# EAGLE design C_Arduino_MEGA2560_ref (EAGLE 6.5.0)
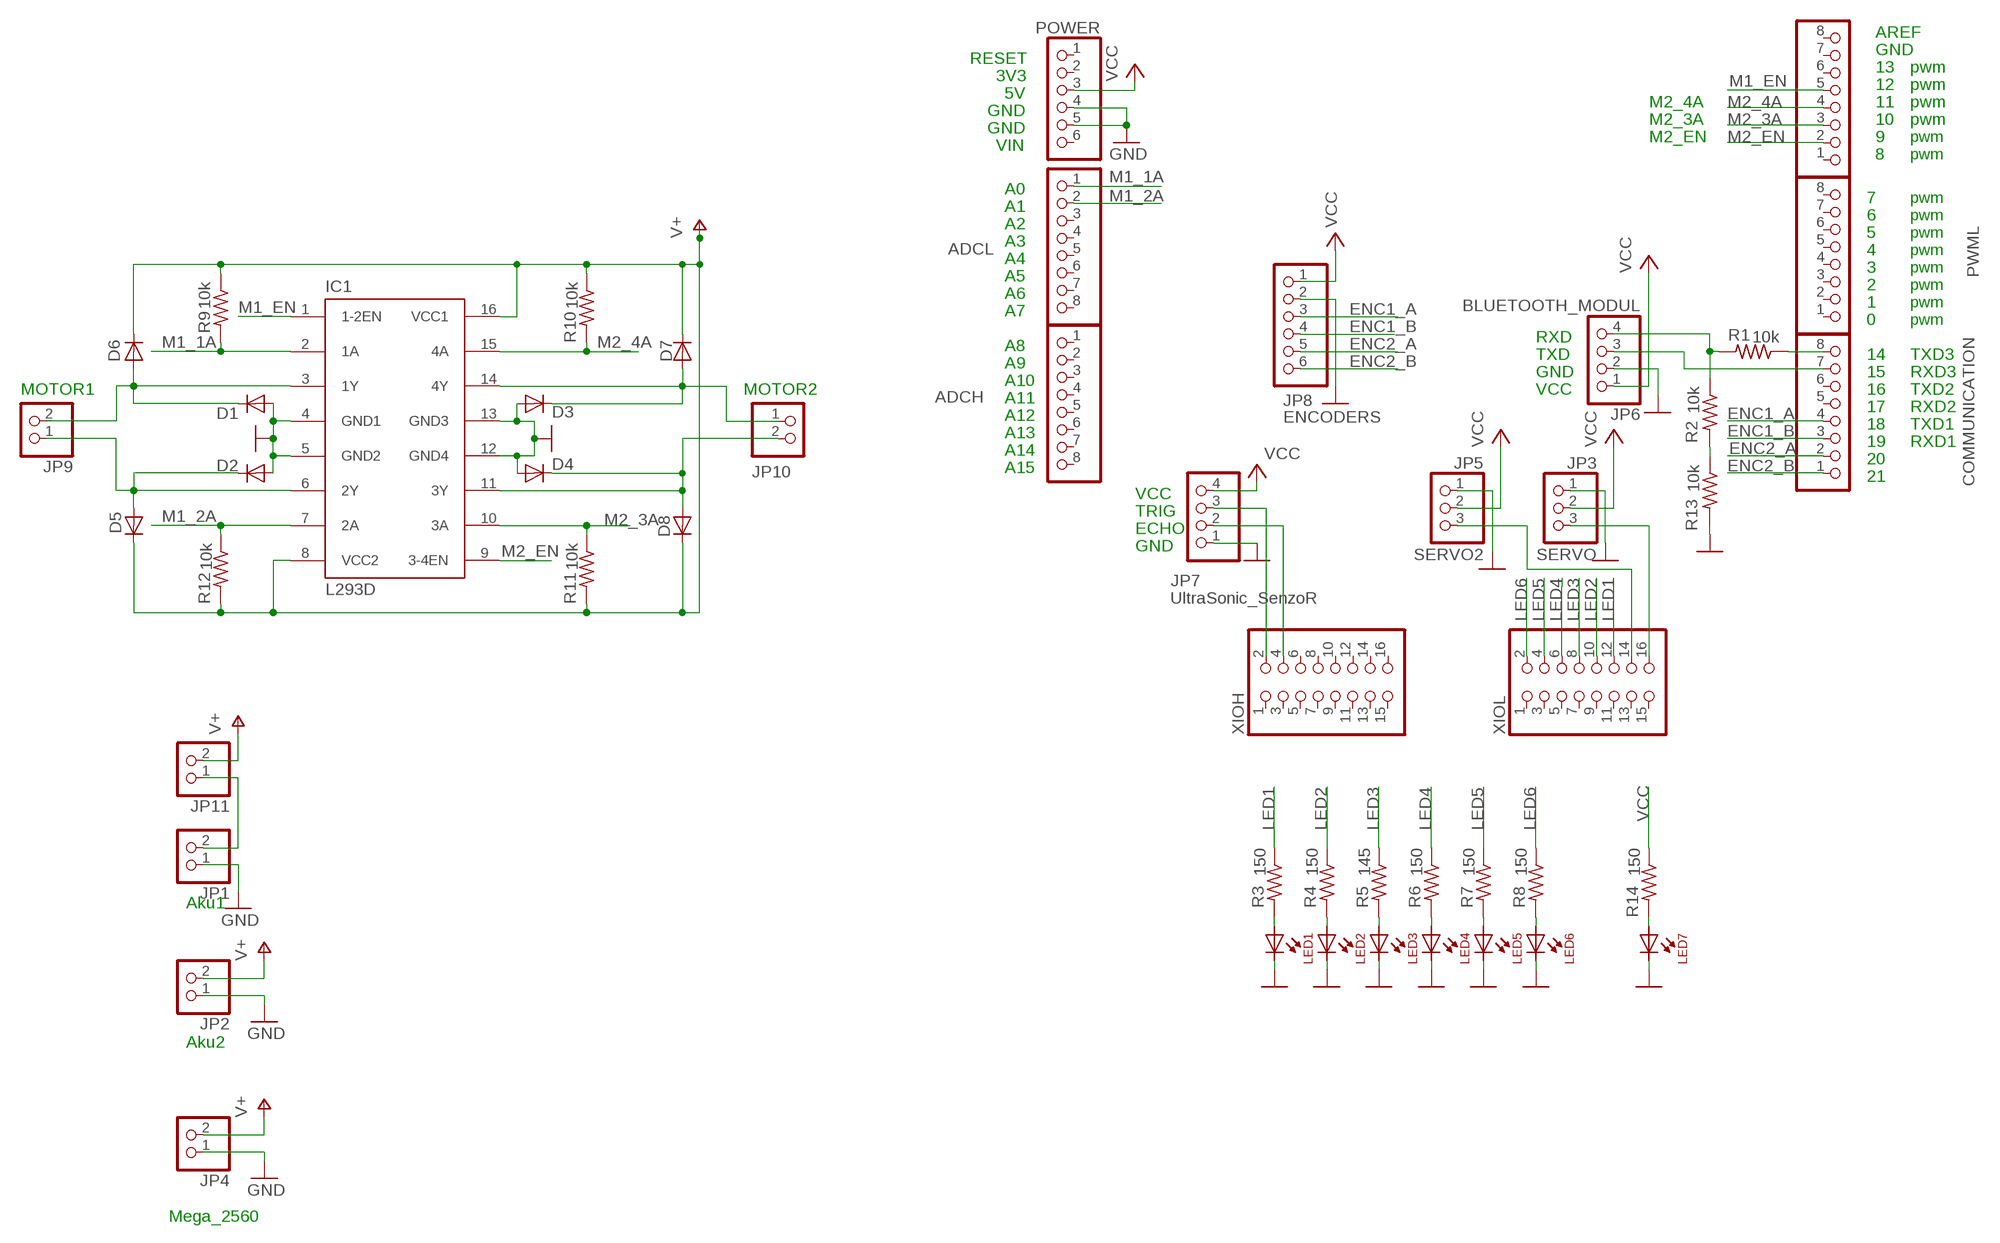
[diagram p0: schematic, sheet 1]

## Parts
ADCH  PINHD-1X8  [1X08]
ADCL  PINHD-1X8  [1X08]
COMMUNICATION  PINHD-1X8  [1X08]
D1  PMLL4150  [SOD80C]
D2  PMLL4150  [SOD80C]
D3  PMLL4150  [SOD80C]
D4  PMLL4150  [SOD80C]
D5  PMLL4150  [SOD80C]
D6  PMLL4150  [SOD80C]
D7  PMLL4150  [SOD80C]
D8  PMLL4150  [SOD80C]
IC1  L293D  [DIL16]
JP1  PINHD-1X2  [1X02]
JP2  PINHD-1X2  [1X02]
JP3  SERVO  PINHD-1X3  [1X03]
JP4  PINHD-1X2  [1X02]
JP5  SERVO2  PINHD-1X3  [1X03]
JP6  BLUETOOTH_MODUL  PINHD-1X4  [1X04]
JP7  UltraSonic_SenzoR  PINHD-1X4  [1X04]
JP8  ENCODERS  PINHD-1X6  [1X06]
JP9  PINHD-1X2  [1X02]
JP10  PINHD-1X2  [1X02]
JP11  PINHD-1X2  [1X02]
LED1  LED_Y_SMD  [LED_Y_SMD]
LED2  LED_Y_SMD  [LED_Y_SMD]
LED3  LED_Y_SMD  [LED_Y_SMD]
LED4  LED_Y_SMD  [LED_Y_SMD]
LED5  LED_Y_SMD  [LED_Y_SMD]
LED6  LED_Y_SMD  [LED_Y_SMD]
LED7  LED_Y_SMD  [LED_Y_SMD]
POWER  PINHD-1X6  [1X06]
PWMH  PINHD-1X8  [1X08]
PWML  PINHD-1X8  [1X08]
R1  10k  R-US_R0805  [R0805]
R2  10k  R-US_R0805  [R0805]
R3  150  R-US_R0805  [R0805]
R4  150  R-US_R0805  [R0805]
R5  145  R-US_R0805  [R0805]
R6  150  R-US_R0805  [R0805]
R7  150  R-US_R0805  [R0805]
R8  150  R-US_R0805  [R0805]
R9  10k  R-US_R0805  [R0805]
R10  10k  R-US_R0805  [R0805]
R11  10k  R-US_R0805  [R0805]
R12  10k  R-US_R0805  [R0805]
R13  10k  R-US_R0805  [R0805]
R14  150  R-US_R0805  [R0805]
XIOH  PINHD-2X8  [2X08]
XIOL  PINHD-2X8  [2X08]

## Nets
ENC1_A: COMMUNICATION.4 JP8.3
ENC1_B: COMMUNICATION.3 JP8.4
ENC2_A: COMMUNICATION.2 JP8.5
ENC2_B: COMMUNICATION.1 JP8.6
GND [Ground]: D1.A D2.A D3.A D4.A IC1.4(GND1) IC1.5(GND2) IC1.12(GND4) IC1.13(GND3) JP1.1 JP2.1 JP3.1 JP4.1 JP5.1 JP6.2 JP7.1 JP8.2 LED1.CATHODE LED2.CATHODE LED3.CATHODE LED4.CATHODE LED5.CATHODE LED6.CATHODE LED7.CATHODE POWER.4 POWER.5 R13.2
LED1: R3.1 XIOL.12
LED2: R4.1 XIOL.10
LED3: R5.1 XIOL.8
LED4: R6.1 XIOL.6
LED5: R7.1 XIOL.4
LED6: R8.1 XIOL.2
M1_1A: ADCL.1 IC1.2(1A) R9.2
M1_2A: ADCL.2 IC1.7(2A) R12.1
M1_EN: IC1.1(1-2EN) PWMH.5
M2_3A: IC1.10(3A) PWMH.3 R11.1
M2_4A: IC1.15(4A) PWMH.4 R10.2
M2_EN: IC1.9(3-4EN) PWMH.2
N$1: D1.C D6.A IC1.3(1Y) JP9.2
N$2: D2.C D5.A IC1.6(2Y) JP9.1
N$3: D3.C D7.A IC1.14(4Y) JP10.1
N$4: D4.C D8.A IC1.11(3Y) JP10.2
N$5: JP3.3 XIOL.16
N$6: COMMUNICATION.7 JP6.3
N$7: COMMUNICATION.8 R1.1
N$8: JP6.4 R1.2 R2.1
N$9: R2.2 R13.1
N$10: JP7.2 XIOH.4
N$11: JP7.3 XIOH.2
N$12: LED1.ANODE R3.2
N$13: LED2.ANODE R4.2
N$14: LED3.ANODE R5.2
N$15: LED4.ANODE R6.2
N$16: LED5.ANODE R7.2
N$17: LED6.ANODE R8.2
N$18: JP5.3 XIOL.14
N$19: LED7.ANODE R14.2
N$20: JP1.2 JP11.1
V+: D5.C D6.C D7.C D8.C IC1.8(VCC2) IC1.16(VCC1) JP2.2 JP4.2 JP11.2 R9.1 R10.1 R11.2 R12.2
VCC [VCC_]: JP3.2 JP5.2 JP6.1 JP7.4 JP8.1 POWER.3 R14.1
Unconnected: ADCH.1 ADCH.2 ADCH.3 ADCH.4 ADCH.5 ADCH.6 ADCH.7 ADCH.8 ADCL.3 ADCL.4 ADCL.5 ADCL.6 ADCL.7 ADCL.8 COMMUNICATION.5 COMMUNICATION.6 POWER.1 POWER.2 POWER.6 PWMH.1 PWMH.6 PWMH.7 PWMH.8 PWML.1 PWML.2 PWML.3 PWML.4 PWML.5 PWML.6 PWML.7 PWML.8 XIOH.1 XIOH.3 XIOH.5 XIOH.6 XIOH.7 XIOH.8 XIOH.9 XIOH.10 XIOH.11 XIOH.12 XIOH.13 XIOH.14 XIOH.15 XIOH.16 XIOL.1 XIOL.3 XIOL.5 XIOL.7 XIOL.9 XIOL.11 XIOL.13 XIOL.15

## Notes on the sheet
- AREF
- GND
- RESET
- 13 | pwm
- 3V3
- 12 | pwm
- 5V
- M2_4A | 11 | pwm
- GND
- M2_3A | 10 | pwm
- GND
- M2_EN | 9 | pwm
- VIN
- 8 | pwm
- A0
- 7 | pwm
- A1
- 6 | pwm
- A2
- 5 | pwm
- A3
- 4 | pwm
- A4
- 3 | pwm
- A5
- 2 | pwm
- A6
- 1 | pwm
- A7
- 0 | pwm
- RXD
- A8
- TXD | 14 | TXD3
- A9
- GND | 15 | RXD3
- A10
- MOTOR1 | MOTOR2 | VCC | 16 | TXD2
- A11
- 17 | RXD2
- A12
- 18 | TXD1
- A13
- 19 | RXD1
- A14
- 20
- A15
- 21
- VCC
- TRIG
- ECHO
- GND
- Aku1
- Aku2
- Mega_2560

## Library data of the parts
ADCH ADCL COMMUNICATION PWMH PWML = pinhead:PINHD-1X8: PIN HEADER
D1-D8 = diode:PMLL4150: DIODE high speed
IC1 = st-microelectronics:L293D: PUSH-PULL 4 CHANNEL DRIVER; MPN: L293D; OC_FARNELL: 9589619; OC_NEWARK: 56P8249
JP1 JP2 JP4 JP9-JP11 = pinhead:PINHD-1X2: PIN HEADER
JP3 JP5 = pinhead:PINHD-1X3: PIN HEADER
JP6 JP7 = pinhead:PINHD-1X4: PIN HEADER
JP8 POWER = pinhead:PINHD-1X6: PIN HEADER
LED1-LED7 = my_lib:LED_Y_SMD
R1-R14 = adafruit:R-US_: RESISTOR, American symbol
XIOH XIOL = pinhead:PINHD-2X8: PIN HEADER

## Net classes
0 default: width 0.508 mm, drill 20 mm, clearance 0.2 mm
1 Ground: width 1.016 mm, drill 20 mm, clearance 0.2 mm
2 VCC_: width 1.016 mm, drill 20 mm, clearance 0.2 mm

## Board
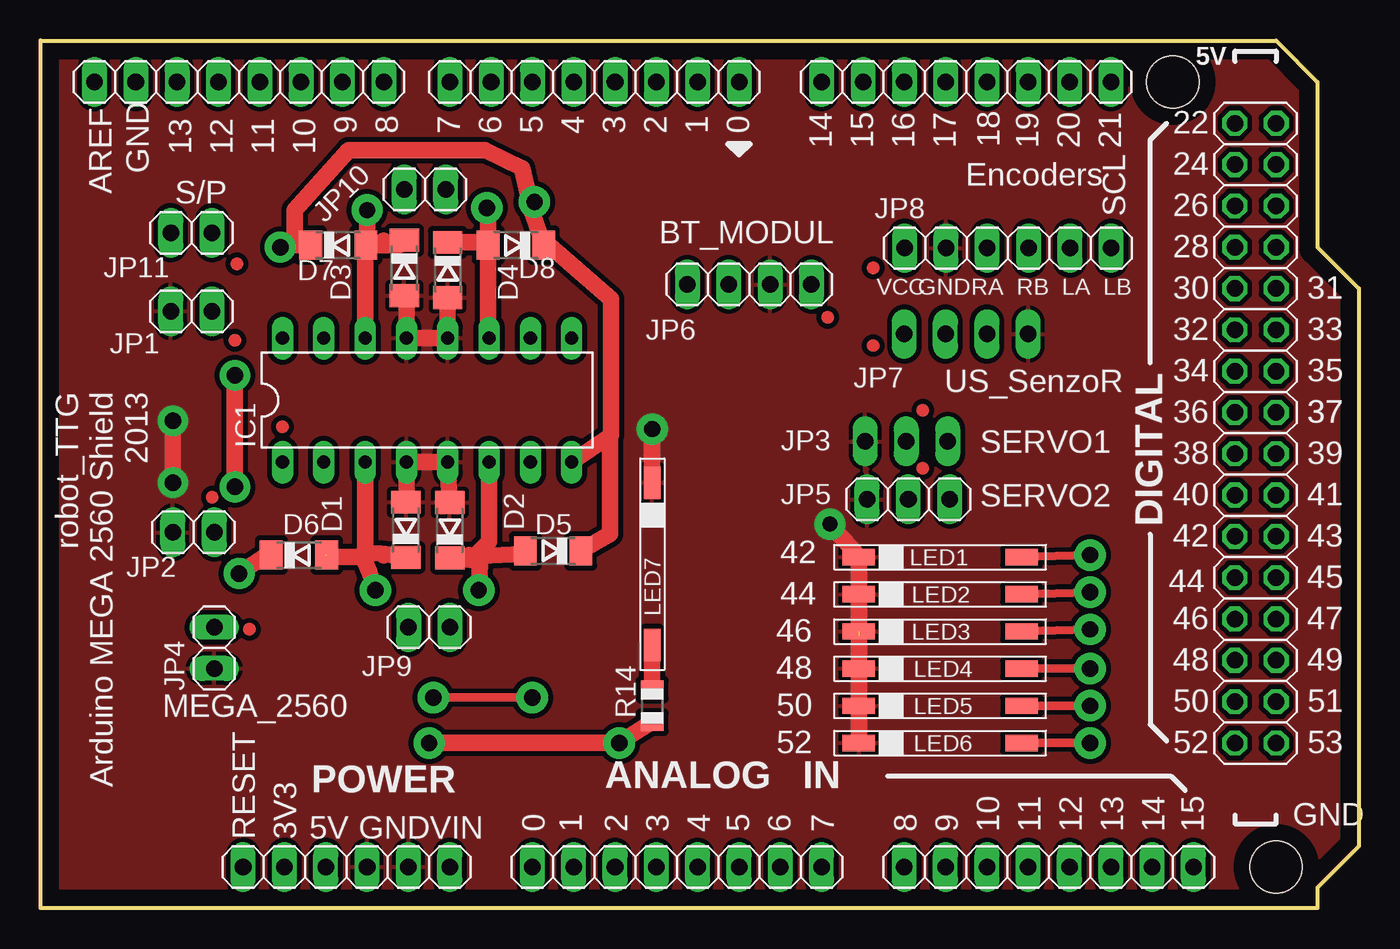
[diagram p1: board, top side]
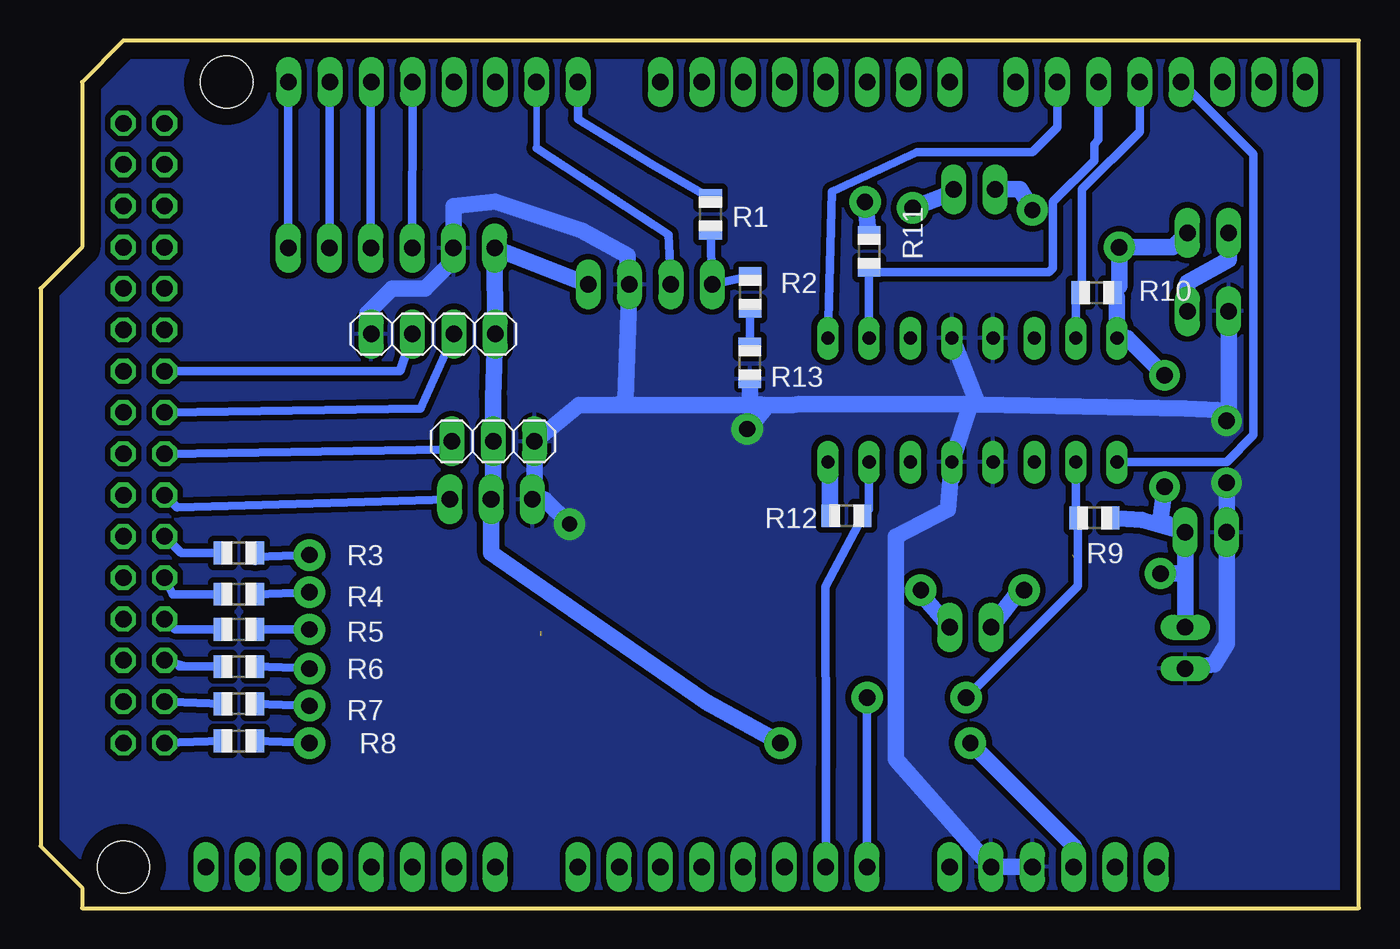
[diagram p2: board, bottom side, seen from below]

Size 81.03 x 53.34 mm. Coordinates in mm from the lower left corner, seen from the top.
Outline: 0,53.34 75.95,53.34 78.49,50.8 78.49,40.64 81.03,38.1 81.03,3.81 78.49,1.27 78.49,0 0,0 0,53.34
Copper layers (1*16): Top 0.035mm / dielectric 1.5mm / Bottom 0.035mm
Design rules "default *": minimum track width 6mil, minimum drill 12mil, track to track 0.2mm, track to pad 0.2mm, pad to pad 0.2mm, via to via 0.2mm, smd to smd 0.2mm, copper to edge 40mil, drill to drill 12mil, minimum pad ring 10mil, minimum via ring 10mil, stop-mask expansion 2mil, vias tented up to drill 1mil, thermal gap 10mil
Holes 3.2 mm at 75.95,2.54 -5.33,50.8 69.6,50.8 -13.46,0.25

### Footprints (pad centres in the part's own frame; a part is rotated, then mirrored left to right if it is on the bottom)
1X08 = drill 1.016 long: 1 -8.89,0; 2 -6.35,0; 3 -3.81,0; 4 -1.27,0; 5 1.27,0; 6 3.81,0; 7 6.35,0; 8 8.89,0
SOD80C = smd 1.4 x 1.8: A 1.7,0; C -1.7,0
DIL16 = drill 0.813 long: 1 -8.89,-3.81; 2 -6.35,-3.81; 3 -3.81,-3.81; 4 -1.27,-3.81; 5 1.27,-3.81; 6 3.81,-3.81; 7 6.35,-3.81; 8 8.89,-3.81; 9 8.89,3.81; 10 6.35,3.81; 11 3.81,3.81; 12 1.27,3.81; 13 -1.27,3.81; 14 -3.81,3.81; 15 -6.35,3.81; 16 -8.89,3.81
1X02 = drill 1.016 long: 1 -1.27,0; 2 1.27,0
1X03 = drill 1.016 long: 1 -2.54,0; 2 0,0; 3 2.54,0
1X04 = drill 1.016 long: 1 -3.81,0; 2 -1.27,0; 3 1.27,0; 4 3.81,0
1X06 = drill 1.016 long: 1 -6.35,0; 2 -3.81,0; 3 -1.27,0; 4 1.27,0; 5 3.81,0; 6 6.35,0
LED_Y_SMD = smd 1 x 2: ANODE 0,-10; CATHODE 0,0
R0805 = smd 1.1 x 1.4: 1 -1,0; 2 1,0
2X08 = drill 1.016 octagon: 1 -8.89,-1.27; 2 -8.89,1.27; 3 -6.35,-1.27; 4 -6.35,1.27; 5 -3.81,-1.27; 6 -3.81,1.27; 7 -1.27,-1.27; 8 -1.27,1.27; 9 1.27,-1.27; 10 1.27,1.27; 11 3.81,-1.27; 12 3.81,1.27; 13 6.35,-1.27; 14 6.35,1.27; 15 8.89,-1.27; 16 8.89,1.27

### Placement (x,y rotation side)
ADCH  61.98,2.54 0 top
ADCL  39.12,2.54 0 top
COMMUNICATION  56.9,50.8 180 top
D1  22.45,23.27 90 top
D2  25.15,23.24 90 top
D3  22.35,39.37 270 top
D4  25.02,39.24 270 top
D5  31.5,21.97 180 top
D6  15.87,21.72 0 top
D7  18.29,40.77 0 top
D8  29.21,40.77 180 top
IC1  23.75,31.24 0 top
JP1  9.27,36.7 0 top
JP2  9.4,23.11 0 top
JP3  53.21,28.7 180 bottom
JP4  10.67,16 90 top
JP5  53.34,25.15 0 top
JP6  43.56,38.35 180 top
JP7  56.9,35.31 0 bottom
JP8  59.46,40.59 0 top
JP9  23.88,17.27 180 top
JP10  23.62,44.2 0 top
JP11  9.27,41.53 0 top
LED1  50.29,21.59 90 top
LED2  50.29,19.3 90 top
LED3  50.29,17.02 90 top
LED4  50.29,14.73 90 top
LED5  50.29,12.45 90 top
LED6  50.29,10.16 90 top
LED7  37.59,26.16 0 top
POWER  18.8,2.54 0 top
PWMH  12.19,50.8 180 top
PWML  34.04,50.8 180 top
R1  39.85,42.67 270 bottom
R2  37.41,37.87 270 bottom
R3  68.83,21.84 0 bottom
R4  68.83,19.3 0 bottom
R5  68.83,17.14 0 bottom
R6  68.83,14.86 0 bottom
R7  68.83,12.57 0 bottom
R8  68.83,10.29 0 bottom
R9  16.26,24 180 bottom
R10  16.13,37.85 180 bottom
R11  30.1,40.39 90 bottom
R12  31.5,24.13 180 bottom
R13  37.44,33.53 270 bottom
R14  37.59,12.45 90 top
XIOH  74.68,39.37 90 top
XIOL  74.68,19.05 90 top

### Tracks (layer width: path | path; a pad name or v marks a point on that pad's centre or on a via)
ENC1_A
  Bottom 0.508: COMMUNICATION.4 58.17,50.11 JP8.3
ENC1_B
  Bottom 0.508: COMMUNICATION.3 60.73,50.77 JP8.4
ENC2_A
  Bottom 0.508: COMMUNICATION.2 63.27,50.77 JP8.5
ENC2_B
  Bottom 0.508: COMMUNICATION.1 65.81,50.77 JP8.6
GND  (via drill 0.9 pad 1.93, 1 pad 1.9, 1 pad 1.93)  (1 unrouted)
  Top 1.016: D4.A IC1.12 IC1.13 22.48,37.54 D3.A | D1.A 22.48,25.25 IC1.4 IC1.5 D2.A | LED3.CATHODE LED2.CATHODE LED1.CATHODE v48.51,23.62 | 50.29,16.76 LED4.CATHODE LED5.CATHODE LED6.CATHODE | v8.13,26.16 v8.13,29.97 | LED7.CATHODE v37.59,29.46
  Bottom 1.016: IC1.12 23.42,30.98 | 23.42,30.98 23.88,30.99 | 23.88,30.99 IC1.5 | 23.88,30.99 34.42,30.99 34.79,30.93 36.32,30.93 | POWER.4 POWER.5 28.45,9.14 28.45,22.86 25.27,24.51 IC1.5 | 25.02,26.42 IC1.5 | JP1.1 8,30.61 | 8,30.61 10.67,30.73 23.42,30.98 | JP7.1 60.96,35.56 60.96,36.58 59.44,38.1 57.4,38.1 55.65,39.85 JP8.2 55.65,43.16 53.09,43.43 47.75,41.66 44.96,40.13 44.96,38.48 JP6.2 45.09,31.31 45.47,30.93 | 36.32,30.93 45.47,30.93 | R13.2 37.44,31.03 36.32,30.93 | v48.51,23.62 50.04,25.15 JP5.1 50.67,25.27 JP3.1 47.94,30.93 45.47,30.93 | v8.13,26.16 JP2.1 8.13,16.26 8.89,14.99 JP4.1 | v8.13,29.97 8,30.61 | v37.59,29.46 37.08,29.97 36.32,30.93
  pour Top (isolate 0.305, rank 2): 82.3,53.59 81.79,-1.4 1.4,-1.02 -0.25,-0.76 -0.25,53.72
  pour Bottom (isolate 0.356, rank 2): 82.42,53.85 81.92,-0.76 -0.76,-0.76 -0.64,0.51 -0.51,49.53 -0.38,53.98
LED1
  Bottom 0.508: XIOL.12 72.39,21.84 R3.1
LED2
  Bottom 0.508: XIOL.10 72.9,19.3 R4.1
LED3
  Bottom 0.508: XIOL.8 72.77,17.14 R5.1
LED4
  Bottom 0.508: XIOL.6 72.14,14.86 | 72.52,14.86 72.14,14.86 | 72.14,14.86 R6.1
LED5
  Bottom 0.508: XIOL.4 73.03,12.7 R7.1
LED6
  Bottom 0.508: XIOL.2 R8.1
M1_1A  (via drill 1 pad 1.93)
  Top 0.508: v24.13,12.95 v30.23,12.95
  Bottom 0.508: IC1.2 17.4,24.15 R9.2 17.26,19.83 v24.13,12.95 | v30.23,12.95 ADCL.1
M1_2A
  Bottom 0.508: IC1.7 30.1,24.53 R12.1 32.78,19.8 32.77,8.64 ADCL.2
M1_EN
  Bottom 0.508: PWMH.5 6.48,46.35 6.48,29.08 8.13,27.43 IC1.1
M2_3A
  Bottom 0.508: PWMH.3 16,47.24 16.26,46.99 16.26,45.97 18.8,43.43 18.8,39.37 19.05,39.12 29.83,39.12 R11.1 IC1.10
M2_4A
  Bottom 0.508: IC1.15 17.4,37.58 R10.2 17.02,37.96 17.02,44.2 13.46,47.75 PWMH.4
M2_EN
  Bottom 0.508: PWMH.2 18.54,48.01 20.07,46.48 27.18,46.48 32.39,44.07 IC1.9
N$1  (via drill 1 pad 1.93)  (1 unrouted)
  Top 1.016: D1.C 21.15,21.77 | 21.15,21.77 20.85,21.82 20.23,21.84 19.94,21.29 | 22.48,21.8 D1.C | 17.53,21.59 19.74,21.59 19.94,21.29 | 22.34,21.45 D1.C | 21.07,21.69 21.15,21.77 | IC1.3 19.94,21.29 | v20.57,19.56 20.19,20.7 19.94,21.29
  Bottom 1.016: JP9.2 20.83,19.56 v20.57,19.56
N$2  (via drill 1 pad 1.93)
  Top 1.016: 26.42,21.41 D2.C 25.07,21.46 | 26.42,21.41 27.05,21.67 | 27.05,21.67 29.62,21.8 D5.A | IC1.6 27.56,22.56 26.42,21.41 | 26.34,21.71 26.42,21.41 | v26.92,19.56 27.05,21.67
  Bottom 1.016: JP9.1 26.67,19.05 v26.92,19.56
N$3  (via drill 1 pad 1.93)
  Top 1.016: IC1.14 19.94,40.72 D7.A | D7.A 21.34,40.77 | 21.34,40.77 22.05,40.77 D3.C | 21.07,41.04 21.34,40.77 | v20.07,42.93 20.07,40.84 D7.A
  Bottom 1.016: JP10.1 20.83,44.2 v20.07,42.93
N$4  (via drill 1 pad 1.93)
  Top 0.508: 25.02,40.77 D4.C
  Top 1.016: 24.89,41.07 D4.C | D4.C 27.33,40.94 D8.A | D8.A 27.51,35.1 IC1.11 | 25.07,40.99 D4.C | v27.43,43.05 27.51,42.85 D8.A
  Bottom 1.016: JP10.2 arc90 25.15,43.94 v27.43,43.05
N$5
  Bottom 0.508: JP3.3 56.01,28.19 XIOL.16
N$6
  Bottom 0.406: COMMUNICATION.7 50.55,46.74
  Bottom 0.508: 50.55,46.74 42.42,41.4 JP6.3
N$7
  Bottom 0.508: COMMUNICATION.8 48.01,48.51 43.42,45.7 R1.1
N$8
  Bottom 0.508: R1.2 JP6.4 R2.1
N$9
  Bottom 0.508: R2.2 R13.1
N$10
  Bottom 0.508: XIOH.4 58.93,33.02 JP7.2
N$11
  Bottom 0.508: JP7.3 57.66,30.73 XIOH.2
N$12  (via drill 1 pad 1.93)
  Top 0.508: LED1.ANODE v64.52,21.72
  Bottom 0.508: v64.52,21.72 67.83,21.59
  Bottom 1.016: 67.83,21.59 R3.2
N$13  (via drill 1 pad 1.93)
  Top 0.508: v64.52,19.43 LED2.ANODE
  Bottom 0.508: R4.2 v64.52,19.43
N$14  (via drill 1 pad 1.93)
  Top 0.508: v64.52,17.14 LED3.ANODE
  Bottom 0.508: R5.2 v64.52,17.14
N$15  (via drill 1 pad 1.93)
  Top 0.508: v64.52,14.73 LED4.ANODE
  Bottom 0.508: R6.2 v64.52,14.73
N$16  (via drill 1 pad 1.93)
  Top 0.508: v64.52,12.45 LED5.ANODE
  Bottom 0.508: R7.2 v64.52,12.45
N$17  (via drill 1 pad 1.93)
  Top 0.508: v64.52,10.16 LED6.ANODE
  Bottom 0.508: R8.2 v64.52,10.16
N$18
  Bottom 0.508: JP5.3 72.64,24.64 XIOL.14
N$19
  Top 1.016: LED7.ANODE R14.2
N$20
  Bottom 1.016: JP1.2 10.54,38.48 8,39.88 JP11.1
V+  (via drill 1 pad 1.9, 1 pad 1.93)
  Top 1.016: D7.C 15.62,40.77 | 15.62,40.77 14.73,40.77 v14.73,40.64 | 30.23,42.72 D8.C 31.24,40.77 35.05,37.47 35.05,29.08 34.99,29.02 | 30.23,42.72 v30.35,43.43 | IC1.8 34.99,29.02 | 30.23,42.72 29.59,45.52 27.3,46.61 18.92,46.61 15.62,42.93 15.62,40.77 | D5.C 34.99,23 34.99,29.02 | D6.C 14.18,21.89 v12.19,20.57 | v11.94,32.77 v11.94,25.91
  Bottom 1.016: v30.35,43.43 R11.2 | R12.2 32.5,27.29 IC1.8 | R9.1 13.35,23.88 JP2.2 | JP4.2 10.67,20.57 | 10.67,20.57 JP2.2 | v12.19,20.57 10.67,20.57 | v11.94,32.77 14.22,35.05 IC1.16 14.86,37.58 R10.1 14.73,38.24 v14.73,40.64 11.43,40.64 JP11.2 | v11.94,25.91 12.19,23.88 JP2.2
VCC  (via drill 1 pad 1.93)
  Top 1.016: v23.88,10.16 v35.56,10.16 35.56,10.18 R14.1
  Bottom 1.016: JP7.4 53.21,35.18 | JP6.1 JP8.1 JP7.4 | JP7.4 53.21,31.37 JP3.2 53.21,25.4 JP5.2 53.34,21.84 40.13,12.7 v35.56,10.16 | POWER.3 17.53,3.81 v23.88,10.16
(copper drawn outside any net)
  shapes: Top circle x10

### Text on the board
tPlace: 18 | 9 | 8 | 7 | 6 | 5 | 4 | 3 | 2 | 1 | 0 | 22 | 14 | 15 | 16 | 17 | 19 | 20 | 21 | 13 | 12 | 11 | 10 | Encoders | 24 | 26 | BT_MODUL | 28 | VCC | GND | RA | RB | LA | LB | 30 | 31 | 32 | 33 | US_SenzoR | robot_TTG / Arduino MEGA 2560 Shield / 2013 | 34 | 35 | 36 | 37 | 37 | SERVO1 | 38 | 39 | SERVO2 | 40 | 41 | LED7 | LED1 | 42 | 43 | 42 | LED2 | 45 | 44 | 44 | LED3 | 46 | 47 | 46 | LED4 | 48 | 49 | 48 | LED5 | 50 | 50 | 51 | LED6 | 52 | 52 | 53 | 0 | 1 | 2 | 3 | 4 | 5 | 6 | 7 | 8 | 9 | 10 | 11 | 12 | 13 | 14 | 15
tNames: 5V | GND | S/P | AREF | SCL | DIGITAL | MEGA_2560 | ANALOG IN | GND | RESET | 3V3 | 5V | GND | VIN
ReferenceLC: L | TX | RX | PC1 | PC2